# EAGLE design XMETER1 (EAGLE 4.16)
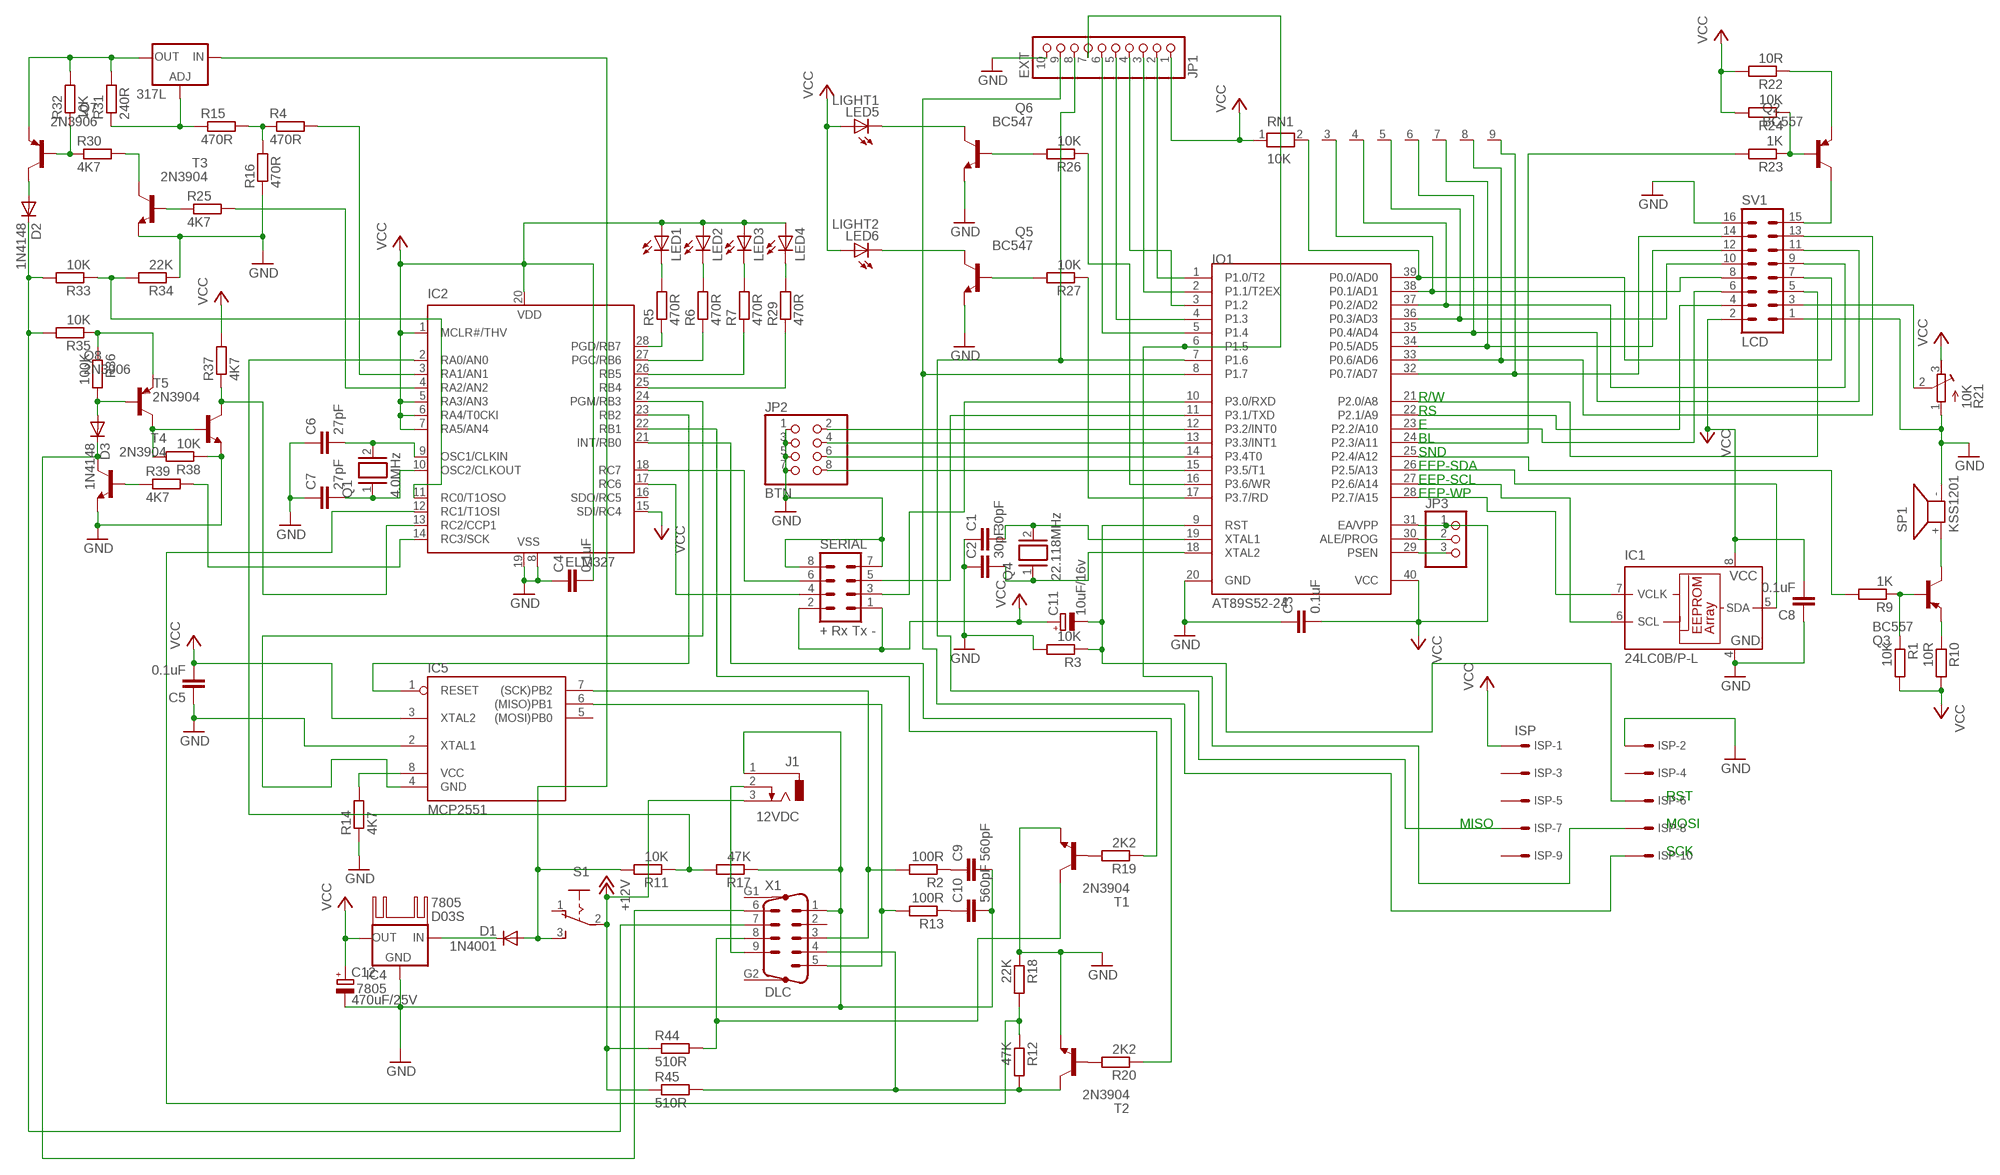
[diagram p0: schematic, sheet 1]

## Parts
317L  LM317L  [317L]
7805  D03S  [D03S]
C1  30pF  C-EU050-024X044  [C050-024X044]
C2  30pF  C-EU050-024X044  [C050-024X044]
C3  0.1uF  C-EU050-024X044  [C050-024X044]
C4  0.1uF  C-EU050-024X044  [C050-024X044]
C5  0.1uF  C-EU050-024X044  [C050-024X044]
C6  27pF  C-EU050-024X044  [C050-024X044]
C7  27pF  C-EU050-024X044  [C050-024X044]
C8  0.1uF  C-EU050-024X044  [C050-024X044]
C9  560pF  C-EU050-024X044  [C050-024X044]
C10  560pF  C-EU050-024X044  [C050-024X044]
C11  10uF/16v  CPOL-EUE5-5  [E5-5]
C12  470uF/25V  CPOL-EUE5-8.5  [E5-8,5]
D1  1N4001  1N4004  [DO41-10]
D2  1N4148  [DO35-10]
D3  1N4148  [DO35-10]
IC1  24LC0B/P-L  24LC21AP  [DIL8]
IC2  ELM327  PIC16LF872P  [DIL28-3]
IC4  7805  78XXS  [78XXS]
IC5  MCP2551  AT90LS2323P  [DIL08]
IO1  AT89S52-24  AT89C55  [PDIP40]
ISP  ISP  057-010-0  [057-010-0]
J1  12VDC  DCJ0202  [DCJ0202]
JP1  EXT  PINHD-1X10  [1X10]
JP2  BTN  PINHD-2X4  [2X04]
JP3  PINHD-1X3  [1X03]
LED1  LED3MM  [LED3MM]
LED2  LED3MM  [LED3MM]
LED3  LED3MM  [LED3MM]
LED4  LED3MM  [LED3MM]
LED5  LIGHT1  LED3MM  [LED3MM]
LED6  LIGHT2  LED3MM  [LED3MM]
Q1  4.0MHz  XTAL/S  [QS]
Q2  BC557  [TO92]
Q3  BC557  [TO92]
Q4  22.118MHz  XTAL/S  [QS]
Q5  BC547  [TO92]
Q6  BC547  [TO92]
Q7  2N3906  [TO92]
Q8  2N3906  [TO92]
R1  10K  R-EU_0207/10  [0207/10]
R2  100R  R-EU_0207/10  [0207/10]
R3  10K  R-EU_0207/10  [0207/10]
R4  470R  R-EU_0207/10  [0207/10]
R5  470R  R-EU_0207/10  [0207/10]
R6  470R  R-EU_0207/10  [0207/10]
R7  470R  R-EU_0207/10  [0207/10]
R9  1K  R-EU_0207/10  [0207/10]
R10  10R  R-EU_0207/10  [0207/10]
R11  10K  R-EU_0207/10  [0207/10]
R12  47K  R-EU_0207/10  [0207/10]
R13  100R  R-EU_0207/10  [0207/10]
R14  4K7  R-EU_0207/10  [0207/10]
R15  470R  R-EU_0207/10  [0207/10]
R16  470R  R-EU_0207/10  [0207/10]
R17  47K  R-EU_0207/10  [0207/10]
R18  22K  R-EU_0207/10  [0207/10]
R19  2K2  R-EU_0207/10  [0207/10]
R20  2K2  R-EU_0207/10  [0207/10]
R21  10K  R-TRIMM3339P  [RTRIM3339P]
R22  10R  R-EU_0207/10  [0207/10]
R23  1K  R-EU_0207/10  [0207/10]
R24  10K  R-EU_0207/10  [0207/10]
R25  4K7  R-EU_0207/10  [0207/10]
R26  10K  R-EU_0207/10  [0207/10]
R27  10K  R-EU_0207/10  [0207/10]
R29  470R  R-EU_0207/10  [0207/10]
R30  4K7  R-EU_0207/10  [0207/10]
R31  240R  R-EU_0207/10  [0207/10]
R32  10K  R-EU_0207/10  [0207/10]
R33  10K  R-EU_0207/10  [0207/10]
R34  22K  R-EU_0207/10  [0207/10]
R35  10K  R-EU_0207/10  [0207/10]
R36  100K  R-EU_0207/10  [0207/10]
R37  4K7  R-EU_0207/10  [0207/10]
R38  10K  R-EU_0207/10  [0207/10]
R39  4K7  R-EU_0207/10  [0207/10]
R44  510R  R-EU_0411/15  [0411/15]
R45  510R  R-EU_0411/15  [0411/15]
RN1  10K  RN08  [RN-9]
S1  M251  [M251]
SERIAL  + Rx Tx -  MA04-2  [MA04-2]
SP1  KSS1201  [KSS1201]
SV1  LCD  MA08-2  [MA08-2]
T1  2N3904  [TO92]
T2  2N3904  [TO92]
T3  2N3904  [TO92]
T4  2N3904  [TO92]
T5  2N3904  [TO92]
X1  DLC  M09HP  [M09HP]

## Nets
+12V [Power]: J1.3 R44.1 R45.1 S1.2(P)
GND: C1.1 C2.1 C3.1 C4.1 C5.1 C6.1 C7.1 C8.1 C9.2 C10.2 C12.- IC1.4(GND) IC2.8(VSS) IC2.19(VSS) IC4.GND IC5.2(XTAL1) IO1.20(GND) ISP.2 J1.1 JP1.10 JP2.1 JP2.3 JP2.5 JP2.7 Q5.1(E) Q6.1(E) R3.2 R14.1 R16.1 R17.1 R18.1 R21.1(E) R34.1 R38.1 SERIAL.7 SERIAL.8 SP1.- SV1.1 SV1.16 T1.3(E) T2.3(E) T3.3(E) T4.3(E) T5.3(E) X1.1
N$1: 317L.3(IN) D1.A R11.2 S1.3(S)
N$2: Q2.3(C) SV1.15
N$3 [Power]: D1.C IC4.IN
N$4: IO1.10(P3.0/RXD) SERIAL.3
N$5: IC2.18(RC7) SERIAL.6
N$6: IC1.5(SDA) IO1.26(P2.5/A13)
N$7: IO1.38(P0.1/AD1) RN1.3 SV1.8
N$8: C11.- IO1.9(RST) ISP.6 R3.1
N$9: IO1.37(P0.2/AD2) RN1.4 SV1.9
N$10: IO1.36(P0.3/AD3) RN1.5 SV1.10
N$11: IO1.35(P0.4/AD4) RN1.6 SV1.11
N$12: IO1.34(P0.5/AD5) RN1.7 SV1.12
N$13: IO1.33(P0.6/AD6) RN1.8 SV1.13
N$14: IO1.32(P0.7/AD7) RN1.9 SV1.14
N$15: Q2.1(E) R22.1
N$16: IO1.23(P2.2/A10) SV1.6
N$17: R21.2(S) SV1.3
N$19: IO1.14(P3.4T0) JP2.6
N$20: C1.2 IO1.19(XTAL1) Q4.2
N$21: IC2.23(RB2) IC5.1(RESET)
N$22: IO1.15(P3.5/T1) JP2.8
N$23: C6.2 IC2.9(OSC1/CLKIN) Q1.2
N$24: Q3.3(C) SP1.+
N$25: C7.2 IC2.10(OSC2/CLKOUT) Q1.1
N$26: IC2.24(PGM/RB3) IC5.4(GND)
N$27: IO1.6(P1.5) ISP.8 JP1.7
N$28: Q2.2(B) R23.1 R24.1
N$29: LED1.K(C) R5.2
N$30: LED2.K(C) R6.2
N$31: LED3.K(C) R7.2
N$32: LED4.K(C) R29.2
N$33: IC2.28(PGD/RB7) R5.1
N$34: IC2.27(PGC/RB6) R6.1
N$35: IC2.26(RB5) R7.1
N$36: IC2.25(RB4) R29.1
N$37: Q3.2(B) R1.1 R9.1
N$38: IO1.13(P3.3/INT1) JP2.4
N$39: IC5.6((MISO)PB1) R13.2 X1.5
N$40: Q3.1(E) R10.1
N$41: IC5.7((SCK)PB2) R2.2 X1.3
N$42: IC2.2(RA0/AN0) R11.1 R17.2
N$43: IC5.8(VCC) R14.2
N$44: C9.1 R2.1
N$45: C10.1 R13.1
N$46: R44.2 T1.1(C) X1.8
N$47: R12.2 R45.2 T2.1(C) X1.4
N$48: IC2.22(RB1) R19.1
N$49: IC2.12(RC1/T1OSI) R12.1 R18.2
N$50: R19.2 T1.2(B)
N$51: R20.2 T2.2(B)
N$52: LED6.K(C) Q5.3(C)
N$53: IO1.39(P0.0/AD0) RN1.2 SV1.7
N$54: IC2.21(INT/RB0) R20.1
N$55: 317L.1(ADJ) R15.1 R31.1
N$56: IO1.7(P1.6) ISP.7 JP1.8
N$57: IO1.8(P1.7) ISP.10 JP1.9
N$58: IO1.12(P3.2/INT0) JP2.2
N$59: IC1.6(SCL) IO1.27(P2.6/A14)
N$60: IO1.25(P2.4/A12) R9.2
N$61: IC1.7(VCLK) IO1.28(P2.7/A15)
N$62: IO1.22(P2.1/A9) SV1.4
N$63: IO1.21(P2.0/A8) SV1.5
N$64: IO1.24(P2.3/A11) R23.2
N$65: LED5.K(C) Q6.3(C)
N$66: C2.2 IO1.18(XTAL2) Q4.1
N$67: J1.2 X1.9
N$68: R4.1 R15.2 R16.2
N$69: IO1.11(P3.1/TXD) SERIAL.5
N$70: IC2.3(RA1/AN1) R4.2
N$71: Q6.2(B) R26.2
N$72: Q5.2(B) R27.2
N$73: IO1.16(P3.6/WR) R26.1
N$74: IO1.17(P3.7/RD) R27.1
N$75: 317L.2(OUT) Q7.3(E) R31.2 R32.2
N$76: Q7.2(B) R30.1 R32.1
N$77: R30.2 T3.1(C)
N$78: IO1.5(P1.4) JP1.6
N$79: IO1.3(P1.2) JP1.4
N$80: IO1.4(P1.3) JP1.5
N$81: IO1.2(P1.1/T2EX) JP1.3
N$82: IO1.1(P1.0/T2) JP1.2
N$83: R25.1 T3.2(B)
N$84: IC2.4(RA2/AN2) R25.2
N$85: D2.A Q7.1(C)
N$86: D2.C R33.2 R35.2 X1.7
N$87: IC2.11(RC0/T1OSO) R33.1 R34.2
N$88: Q8.1(C) R38.2 T5.2(B)
N$89: D3.A Q8.2(B) R36.2
N$90: Q8.3(E) R35.1 R36.1
N$91: IC2.14(RC3/SCK) R39.2
N$92: R39.1 T4.2(B)
N$93: D3.C T4.1(C) X1.6
N$95: IC2.13(RC2/CCP1) R37.1 T5.1(C)
N$99: IO1.30(ALE/PROG) JP3.2
N$100: IO1.29(PSEN) JP3.3
N$103: IC2.17(RC6) SERIAL.4
VCC: C3.2 C4.2 C5.2 C8.2 C11.+ C12.+ IC1.8(VCC) IC2.1(MCLR#/THV) IC2.5(RA3/AN3) IC2.6(RA4/T0CKI) IC2.7(RA5/AN4) IC2.15(SDI/RC4) IC2.20(VDD) IC4.OUT IC5.3(XTAL2) IO1.31(EA/VPP) IO1.40(VCC) ISP.1 JP1.1 JP3.1 LED1.A LED2.A LED3.A LED4.A LED5.A LED6.A R1.2 R10.2 R21.3(A) R22.2 R24.2 R37.2 RN1.1 SERIAL.1 SERIAL.2 SV1.2
Unconnected: IC2.16(SDO/RC5) IC5.5((MOSI)PB0) ISP.3 ISP.4 ISP.5 ISP.9 S1.1(O) X1.2 X1.G1 X1.G2

## Notes on the sheet
- R/W
- RS
- E
- BL
- SND
- EEP-SDA
- EEP-SCL
- EEP-WP
- RST
- MISO | MOSI
- SCK

## Library data of the parts
317L = v-reg:LM317L: VOLTAGE REGULATOR
7805 = heatsink:D03S: HEATSINK distributor Schukat
C1-C10 = rcl:C-EU: CAPACITOR, European symbol
C11 C12 = rcl:CPOL-EU: POLARIZED CAPACITOR, European symbol
D1 = diode:1N4004: DIODE general purpose rectifier, 1 A
D2 D3 = diode:1N4148: DIODE high speed (Philips)
IC1 = microchip:24L*: Serial EEPROM 128 byte/1 K
IC2 = microchip:PIC16*872: MICROCONTROLLER flash type
IC4 = v-reg:78XXS: VOLTAGE REGULATOR
IC5 = atmel:AT90*2323: MICROCONTROLLER 2 Kbytes FLASH 128 bytes SRAM 128 bytes EEPROM
IO1 = atmel89cxxxx:AT89C55
ISP = con-panduit:057-010-: CONNECTOR 10-pin series 057 contact pc board low profile headers
J1 = con-jack:DCJ0202: DC POWER JACK Source: DCJ0202.pdf
JP1 = pinhead:PINHD-1X10: PIN HEADER
JP2 = pinhead:PINHD-2X4: PIN HEADER
JP3 = pinhead:PINHD-1X3: PIN HEADER
LED1-LED6 = led:LED: LED OSRAM: - CHIPLED LG R971, LG N971, LY N971, LG Q971, LY Q971, LO R971, LY R971 LH N974, LH R974 LS Q976, LO Q976, LY Q976 LO Q996 - Hyper CHIPLED LW Q18S LB Q993, LB Q99A, LB R99A - SideLED LS A670, LO A670, LY A670, LG A670, LP A670 LB A673, LV A673, LT A673, LW A673 LH A674 LY A675 LS A676, LA A676, LO A676, LY A676, LW A676 LS A679, LY A679, LG A679 - Hyper Micro SIDELED® LS Y876, LA Y876, LO Y876, LY Y876 LT Y87S - SmartLED LW L88C, LW L88S LB L89C, LB L89S, LG L890 LS L89K, LO L89K, LY L89K LS L896, LA L896, LO L896, LY L896 - TOPLED LS T670, LO T670, LY T670, LG T670, LP T670 LSG T670, LSP T670, LSY T670, LOP T670, LYG T670 LG T671, LOG T671, LSG T671 LB T673, LV T673, LT T673, LW T673 LH T674 LS T676, LA T676, LO T676, LY T676, LB T676, LH T676, LSB T676, LW T676 LB T67C, LV T67C, LT T67C, LS T67K, LO T67K, LY T67K, LW E67C LS E67B, LA E67B, LO E67B, LY E67B, LB E67C, LV E67C, LT E67C LW T67C LS T679, LY T679, LG T679 LS T770, LO T770, LY T770, LG T770, LP T770 LB T773, LV T773, LT T773, LW T773 LH T774 LS E675, LA E675, LY E675, LS T675 LS T776, LA T776, LO T776, LY T776, LB T776 LHGB T686 LT T68C, LB T68C - Hyper Mini TOPLED® LB M676 - Mini TOPLED Santana® LG M470 LS M47K, LO M47K, LY M47K Source: http://www.osram.convergy.de - LUMILED® LXK2-PW12-R00, LXK2-PW12-S00, LXK2-PW14-U00, LXK2-PW14-V00 LXK2-PM12-R00, LXK2-PM12-S00, LXK2-PM14-U00 LXK2-PE12-Q00, LXK2-PE12-R00, LXK2-PE12-S00, LXK2-PE14-T00, LXK2-PE14-U00 LXK2-PB12-K00, LXK2-PB12-L00, LXK2-PB12-M00, LXK2-PB14-N00, LXK2-PB14-P00, LXK2-PB14-Q00 LXK2-PR12-L00, LXK2-PR12-M00, LXK2-PR14-Q00, LXK2-PR14-R00 LXK2-PD12-Q00, LXK2-PD12-R00, LXK2-PD12-S00 LXK2-PH12-R00, LXK2-PH12-S00 LXK2-PL12-P00, LXK2-PL12-Q00, LXK2-PL12-R00 Source: www.luxeon.com
Q1 Q4 = special:XTAL/S: CRYSTAL
Q2 Q3 = transistor-pnp:BC557: PNP Transistor
Q5 Q6 = transistor-npn:BC547*: NPN Transistor
Q7 Q8 = transistor-pnp:2N3906: PNP Transistor
R1-R7 R9-R20 R22-R27 R29-R39 R44 R45 = rcl:R-EU_: RESISTOR, European symbol
R21 = rcl:R-TRIMM: Trimm resistor
RN1 = resistor-net:RN08: RESISTOR NETWORK
S1 = switch:M251: SLIDING SWITCH Mors, distributor Buerklin, 11G702
SERIAL = con-lstb:MA04-2: PIN HEADER
SP1 = buzzer:KSS1201: SPEAKER Source: Schukat
SV1 = con-lstb:MA08-2: PIN HEADER
T1-T5 = transistor:2N3904: NPN TRANSISTOR
X1 = con-subd:M09HP: SUB-D

## Net classes
0 Signal: width 0.5 mm, drill 0.013 mm
1 Ground: width 1 mm, drill 0.2 mm
2 Power: width 1 mm, drill 0.2 mm

## Board
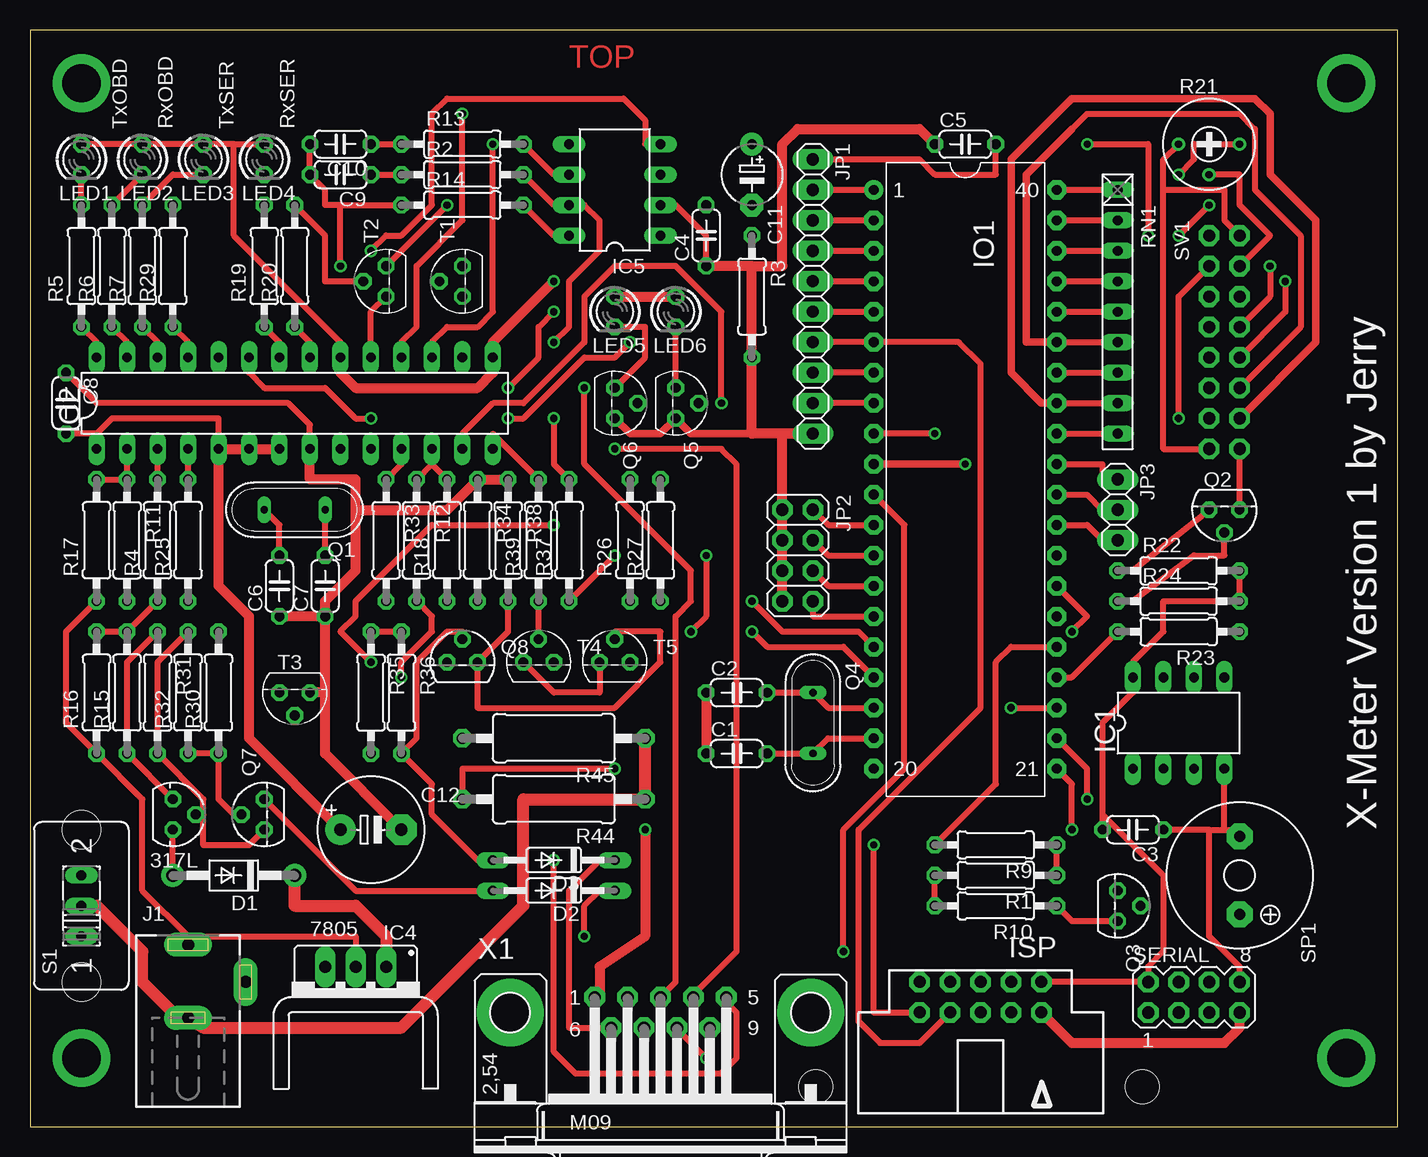
[diagram p1: board, top side]
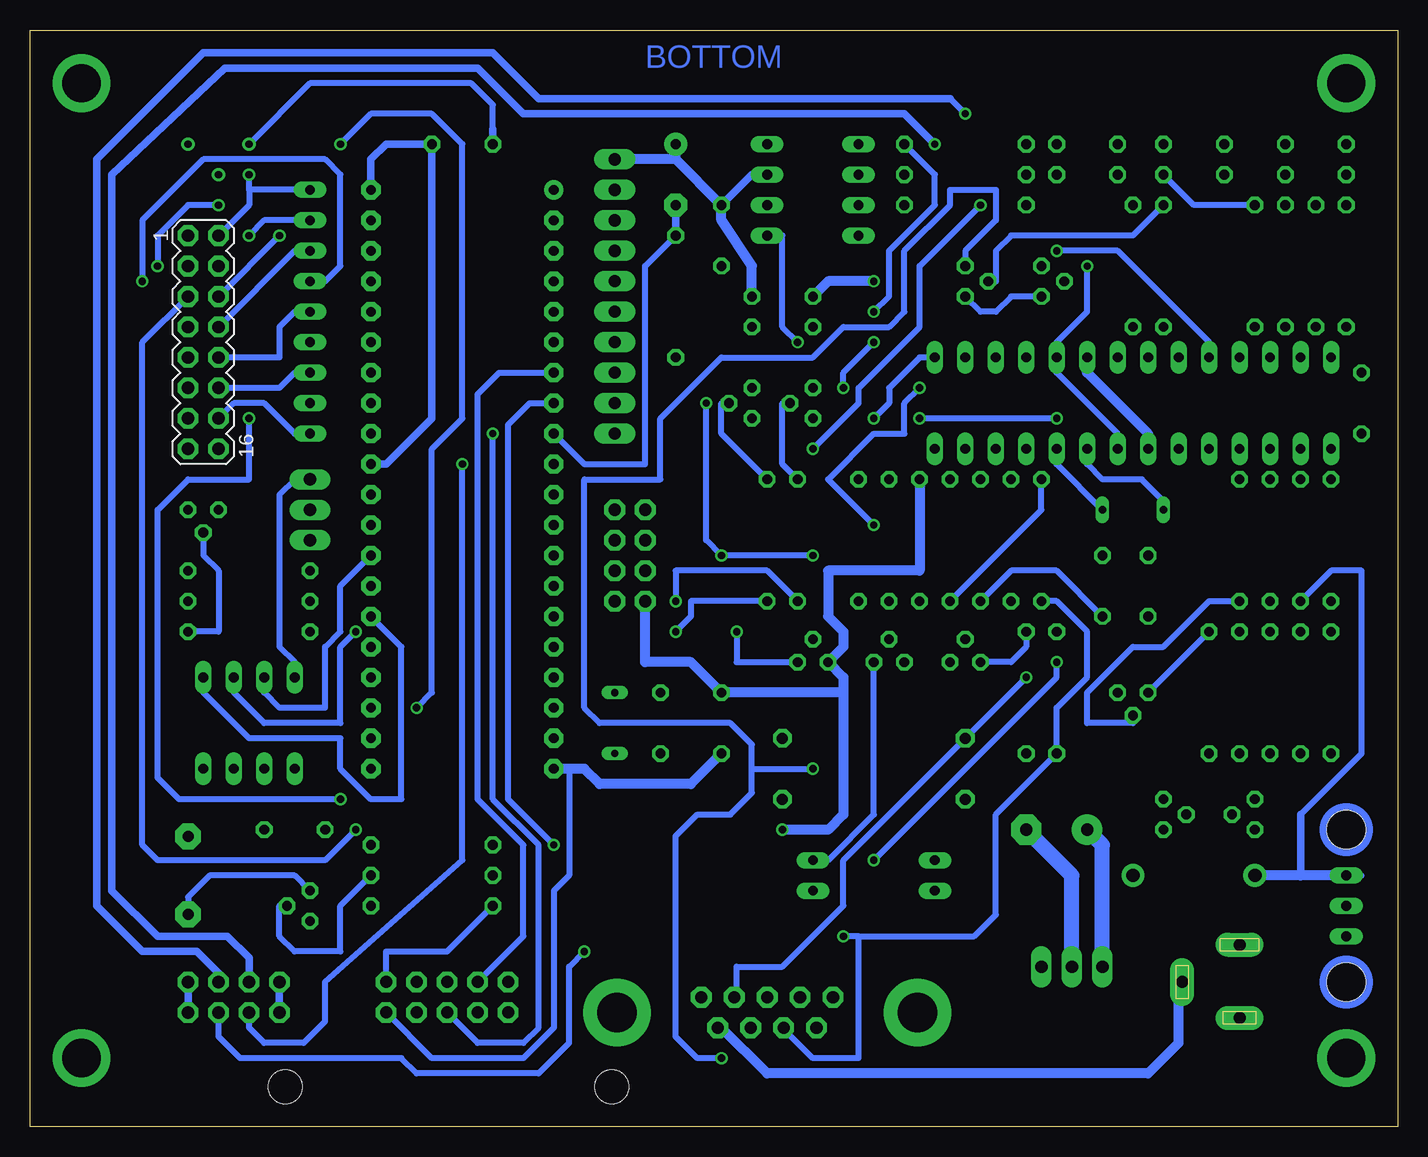
[diagram p2: board, bottom side, seen from below]

Size 113.97 x 91.43 mm. Coordinates in mm from the lower left corner, seen from the top.
Outline: 0,0 113.97,0 113.97,91.43 0,91.43 0,0
Copper layers (1*16): Top 0.035mm / dielectric 1.5mm / Bottom 0.035mm
Design rules "default": minimum track width 15mil, minimum drill 24mil, track to track 15mil, track to pad 15mil, pad to pad 15mil, via to via 15mil, smd to smd 8mil, copper to edge 40mil, drill to drill 8mil, minimum pad ring 10mil, minimum via ring 8mil, stop-mask expansion 4mil, vias tented up to drill 0mil, thermal gap 10mil
Holes 3.2 mm at 4.28,24.76 4.28,12.06

### Footprints (pad centres in the part's own frame; a part is rotated, then mirrored left to right if it is on the bottom)
317L = drill 0.813 octagon: 1 -1.27,0; 2 0,1.905; 3 1.27,0
C050-024X044 = drill 0.813 octagon: 1 -2.54,0; 2 2.54,0
E5-5 = drill 0.813 pad 1.905 round: + -2.54,0 | drill 0.813 pad 1.905 octagon: - 2.54,0
E5-8,5 = drill 1.016 pad 2.54 round: + -2.54,0 | drill 1.016 pad 2.54 octagon: - 2.54,0
DO41-10 = drill 1.118 round: A 5.08,0; C -5.08,0
DO35-10 = drill 0.813 long: A 5.08,0; C -5.08,0
DIL8 = drill 0.813 long: 1 -3.81,-3.81; 2 -1.27,-3.81; 3 1.27,-3.81; 4 3.81,-3.81; 5 3.81,3.81; 6 1.27,3.81; 7 -1.27,3.81; 8 -3.81,3.81
DIL28-3 = drill 0.813 long: 1 -16.51,-3.81; 2 -13.97,-3.81; 3 -11.43,-3.81; 4 -8.89,-3.81; 5 -6.35,-3.81; 6 -3.81,-3.81; 7 -1.27,-3.81; 8 1.27,-3.81; 9 3.81,-3.81; 10 6.35,-3.81; 11 8.89,-3.81; 12 11.43,-3.81; 13 13.97,-3.81; 14 16.51,-3.81; 15 16.51,3.81; 16 13.97,3.81; 17 11.43,3.81; 18 8.89,3.81; 19 6.35,3.81; 20 3.81,3.81; 21 1.27,3.81; 22 -1.27,3.81; 23 -3.81,3.81; 24 -6.35,3.81; 25 -8.89,3.81; 26 -11.43,3.81; 27 -13.97,3.81; 28 -16.51,3.81
78XXS = drill 1.016 long: GND 0,-2.54; IN -2.54,-2.54; OUT 2.54,-2.54
DIL08 = drill 0.813 long: 1 -3.81,-3.81; 2 -1.27,-3.81; 3 1.27,-3.81; 4 3.81,-3.81; 5 3.81,3.81; 6 1.27,3.81; 7 -1.27,3.81; 8 -3.81,3.81
PDIP40 = drill 0.813 pad 1.6 round: 1 -19.05,-7.62 | drill 0.813 pad 1.6 octagon: 2 -16.51,-7.62; 3 -13.97,-7.62; 4 -11.43,-7.62; 5 -8.89,-7.62; 6 -6.35,-7.62; 7 -3.81,-7.62; 8 -1.27,-7.62; 9 1.27,-7.62; 10 3.81,-7.62; 11 6.35,-7.62; 12 8.89,-7.62; 13 11.43,-7.62; 14 13.97,-7.62; 15 16.51,-7.62; 16 19.05,-7.62; 17 21.59,-7.62; 18 24.13,-7.62; 19 26.67,-7.62; 20 29.21,-7.62; 21 29.21,7.62; 22 26.67,7.62; 23 24.13,7.62; 24 21.59,7.62; 25 19.05,7.62; 26 16.51,7.62; 27 13.97,7.62; 28 11.43,7.62; 29 8.89,7.62; 30 6.35,7.62; 31 3.81,7.62; 32 1.27,7.62; 33 -1.27,7.62; 34 -3.81,7.62; 35 -6.35,7.62; 36 -8.89,7.62; 37 -11.43,7.62; 38 -13.97,7.62; 39 -16.51,7.62; 40 -19.05,7.62
057-010-0 = drill 1 octagon: 1 -5.08,-5.08; 2 -5.08,-2.54; 3 -2.54,-5.08; 4 -2.54,-2.54; 5 0,-5.08; 6 0,-2.54; 7 2.54,-5.08; 8 2.54,-2.54; 9 5.08,-5.08; 10 5.08,-2.54 | hole 2.8: -13.48,3.66; 13.73,3.66
DCJ0202 = drill 1 pad 2 long: 1 0,3.1; 2 4.8,0; 3 0,-3
1X10 = drill 1.016 long: 1 -11.43,0; 2 -8.89,0; 3 -6.35,0; 4 -3.81,0; 5 -1.27,0; 6 1.27,0; 7 3.81,0; 8 6.35,0; 9 8.89,0; 10 11.43,0
2X04 = drill 1.016 octagon: 1 -3.81,-1.27; 2 -3.81,1.27; 3 -1.27,-1.27; 4 -1.27,1.27; 5 1.27,-1.27; 6 1.27,1.27; 7 3.81,-1.27; 8 3.81,1.27
1X03 = drill 1.016 long: 1 -2.54,0; 2 0,0; 3 2.54,0
LED3MM = drill 0.813 octagon: A -1.27,0; K 1.27,0
QS = drill 0.61 long: 1 -2.54,0; 2 2.54,0
TO92 = drill 0.813 octagon: 1 1.27,0; 2 0,1.905; 3 -1.27,0
0207/10 = drill 0.813 octagon: 1 -5.08,0; 2 5.08,0
RTRIM3339P = drill 0.61 round: 1 -2.54,0; 2 0,-2.54; 3 2.54,0
0411/15 = drill 0.914 octagon: 1 -7.62,0; 2 7.62,0
RN-9 = drill 0.813 long: 1 -10.16,0; 2 -7.62,0; 3 -5.08,0; 4 -2.54,0; 5 0,0; 6 2.54,0; 7 5.08,0; 8 7.62,0; 9 10.16,0
M251 = drill 0.813 long: 1 -2.54,0; 2 0,0; 3 2.54,0
MA04-2 = drill 1.016 octagon: 1 -3.81,-1.27; 2 -3.81,1.27; 3 -1.27,-1.27; 4 -1.27,1.27; 5 1.27,-1.27; 6 1.27,1.27; 7 3.81,-1.27; 8 3.81,1.27
KSS1201 = drill 0.914 pad 2.159 octagon: + 3.251,0; - -3.251,0
MA08-2 = drill 1.016 octagon: 1 -8.89,-1.27; 2 -8.89,1.27; 3 -6.35,-1.27; 4 -6.35,1.27; 5 -3.81,-1.27; 6 -3.81,1.27; 7 -1.27,-1.27; 8 -1.27,1.27; 9 1.27,-1.27; 10 1.27,1.27; 11 3.81,-1.27; 12 3.81,1.27; 13 6.35,-1.27; 14 6.35,1.27; 15 8.89,-1.27; 16 8.89,1.27
M09HP = drill 1.016 octagon: 1 -5.486,1.27; 2 -2.743,1.27; 3 0,1.27; 4 2.743,1.27; 5 5.486,1.27; 6 -4.115,-1.27; 7 -1.372,-1.27; 8 1.372,-1.27; 9 4.115,-1.27 | drill 3.302 pad 5.08 round: G1 -12.522,0; G2 12.522,0

### Placement (x,y rotation side)
317L  11.9,26.03 270 top
7805  27.14,9.52 180 top
C1  58.89,31.11 0 top
C2  58.89,36.19 0 top
C3  91.91,24.76 180 top
C4  56.35,74.29 90 top
C5  77.94,81.91 0 top
C6  20.79,45.08 90 top
C7  24.6,45.08 90 top
C8  3.01,60.32 270 top
C9  25.87,79.37 180 top
C10  25.87,81.91 180 top
C11  60.16,79.37 270 top
C12  28.41,24.76 0 top
D1  16.98,20.95 180 top
D2  43.65,19.68 180 top
D3  43.65,22.22 180 top
IC1  95.72,33.65 0 top
IC2  22.06,60.32 0 top
IC4  27.14,10.79 180 top
IC5  48.73,78.1 90 top
IO1  77.94,59.05 270 top
ISP  79.21,6.98 180 top
J1  13.17,12.06 0 top
JP1  65.24,69.21 270 top
JP2  63.97,47.62 270 top
JP3  90.64,51.43 270 top
LED1  4.28,80.64 270 top
LED2  9.36,80.64 270 top
LED3  14.44,80.64 270 top
LED4  19.52,80.64 270 top
LED5  48.73,67.94 270 top
LED6  53.81,67.94 270 top
Q1  22.06,51.43 180 top
Q2  99.53,51.43 180 top
Q3  90.64,18.41 270 top
Q4  65.24,33.65 270 top
Q5  53.81,60.32 270 top
Q6  48.73,60.32 270 top
Q7  19.52,26.03 90 top
Q8  36.03,38.73 0 top
R1  80.48,20.95 180 top
R2  36.03,79.37 0 top
R3  60.16,69.21 270 top
R4  10.63,48.89 90 top
R5  4.28,71.75 90 top
R6  6.82,71.75 90 top
R7  9.36,71.75 90 top
R9  80.48,23.49 180 top
R10  80.48,18.41 180 top
R11  8.09,48.89 270 top
R12  32.22,48.89 270 top
R13  36.03,81.91 0 top
R14  36.03,76.83 0 top
R15  8.09,36.19 90 top
R16  5.55,36.19 90 top
R17  5.55,48.89 90 top
R18  34.76,48.89 90 top
R19  19.52,71.75 90 top
R20  22.06,71.75 90 top
R21  98.26,81.91 0 top
R22  95.72,46.35 0 top
R23  95.72,41.27 180 top
R24  95.72,43.81 0 top
R25  13.17,48.89 90 top
R26  50,48.89 90 top
R27  52.54,48.89 90 top
R29  11.9,71.75 90 top
R30  15.71,36.19 90 top
R31  10.63,36.19 270 top
R32  13.17,36.19 90 top
R33  29.68,48.89 270 top
R34  37.3,48.89 270 top
R35  28.41,36.19 270 top
R36  30.95,36.19 270 top
R37  44.92,48.89 90 top
R38  39.84,48.89 270 top
R39  42.38,48.89 90 top
R44  43.65,27.3 180 top
R45  43.65,32.38 180 top
RN1  90.64,67.94 270 top
S1  4.28,18.41 90 top
SERIAL  96.99,10.79 0 top
SP1  100.8,20.95 270 top
SV1  99.53,65.4 270 bottom
T1  36.03,70.48 90 top
T2  29.68,70.48 90 top
T3  22.06,36.19 180 top
T4  42.38,38.73 0 top
T5  48.73,38.73 0 top
X1  52.54,9.52 0 top

### Tracks (layer width: path | path; a pad name or v marks a point on that pad's centre or on a via)
+12V
  Top 1: R45.1 R44.1 41.11,27.3 41.11,18.41 30.95,8.25 14.44,8.25 J1.3 11.9,9.52 9.36,12.06 9.36,14.6 5.55,18.41 S1.2
GND  (via drill 0.61)
  Top 0.5: SV1.16 94.45,56.51 94.45,78.1 | 94.45,78.1 94.45,80.64 R21.1 | C4.1 56.35,74.29 53.81,76.83 IC5.2 | T4.3 43.65,36.19 47.46,36.19 T5.3 | 47.46,10.79 X1.1 | C10.2 C9.2 24.6,78.1 24.6,76.83 25.87,76.83 | 25.87,76.83 R14.1 | C8.1 5.55,60.32 21.53,60.32 23.33,58.52 IC2.8 | T2.3 28.41,67.94 IC2.19 | v25.87,71.75 25.87,76.83 | R17.1 3.01,41.27 3.01,33.65 R16.1 9.36,27.3 9.36,19.68 13.17,15.87 | 13.17,15.87 27.14,15.87 IC4.GND | J1.1 13.17,15.87 | 99.53,24.76 100.8,24.76 SP1.- | 98.26,24.76 99.53,24.76 | 98.26,24.76 C3.1 | 99.53,24.76 IC1.4 | SERIAL.8 100.8,13.33 98.26,15.87 98.26,24.76 | SV1.1 99.53,75.56 99.53,78.1 94.45,78.1
  Top 0.61: 60.16,57.78 55.08,57.78 Q5.1 52.54,57.78 50,57.78 Q6.1
  Top 0.813: C2.1 C1.1 | 47.46,10.79 47.46,13.33 51.27,15.87 v51.27,24.76 | R38.1 R34.1 34.76,51.43 27.14,51.43 | IC2.8 23.33,53.97 27.14,53.97 27.14,51.43 | 27.14,51.43 27.14,46.35 24.6,43.81 C7.1 | C7.1 C6.1 | 24.6,36.19 C7.1 | 24.6,36.19 T3.3 | 24.6,36.19 24.6,31.11 C12.- | JP2.7 JP2.5 JP2.3 JP2.1 62.7,57.78 JP1.10 60.16,57.78 R3.2 60.16,71.75 | 60.16,71.75 C4.1 | 60.16,71.75 62.7,71.75 62.7,81.91 63.97,83.18 74.13,83.18 C5.1 | ISP.2 86.83,6.98 99.53,6.98 100.8,8.25 SERIAL.7
  Bottom 0.5: R21.1 90.64,86.99 77.2,86.99 75.4,85.19 75.4,83.18 | IC2.8 23.33,57.78 28.41,62.86 IC2.19 28.41,65.4 25.87,67.94 v25.87,71.75 | T2.3 32.22,69.21 33.49,67.94 34.76,67.94 T1.3 | R18.1 32.22,46.35 28.41,46.35 C7.1 | IC4.GND 27.14,14.6 | ISP.2 80.48,5.71 72.86,5.71 70.32,8.25 70.32,19.68 69.05,20.95 69.05,29.84 IO1.20
  Bottom 0.61: SERIAL.7 SERIAL.8 | C5.1 75.4,83.18
  Bottom 0.813: 46.19,36.19 C2.1 58.89,38.73 62.7,38.73 JP2.7 | 46.19,36.19 46.19,26.03 47.46,24.76 v51.27,24.76 | 46.19,36.19 46.19,37.46 T5.3 46.19,40 46.19,41.27 47.46,42.54 47.46,46.35 39.84,46.35 R38.1 | C1.1 58.89,28.57 66.51,28.57 67.78,29.84 IO1.20
  Bottom 1.27: C12.- 27.14,20.95 IC4.GND
N$1
  Top 0.5: D1.A 317L.3
  Bottom 0.5: S1.3 3.01,20.95 | R11.2 5.55,46.35 3.01,46.35 3.01,31.11 8.09,26.03
  Bottom 0.61: 8.09,20.95 8.09,26.03
  Bottom 0.813: S1.3 8.09,20.95 D1.A
N$2
  Top 0.5: Q2.3 SV1.15
N$3
  Top 1: D1.C 22.06,18.41 27.14,18.41 29.68,15.87 IC4.IN
N$4  (via drill 0.61)
  Top 0.61: v77.94,55.24 IO1.10
  Bottom 0.5: v77.94,55.24 77.94,22.22 89.37,12.06 89.37,8.78 91.17,6.98 94.45,6.98 95.72,8.25 SERIAL.3
N$5  (via drill 0.61)
  Top 0.5: v36.03,84.45 36.03,75.56 32.22,71.75 32.22,66.67 30.95,65.4 IC2.18
  Bottom 0.5: v36.03,84.45 37.3,85.72
  Bottom 0.61: SERIAL.6 98.26,12.8 100.06,14.6 104.61,14.6 108.42,18.41 108.42,80.64 99.53,89.53 75.4,89.53 71.59,85.72 37.3,85.72
N$6
  Bottom 0.5: IO1.26 83.02,40 83.02,27.3 85.56,27.3 88.1,29.84 88.1,32.38 95.72,32.38 99.53,36.19 IC1.5
N$7
  Top 0.5: IO1.38 RN1.3
  Bottom 0.5: SV1.8 91.91,73.02 RN1.3
N$8  (via drill 0.61)
  Top 0.5: v75.4,57.78 IO1.9
  Bottom 0.5: IO1.9 67.78,55.24 62.7,55.24 62.7,71.75 R3.1 | ISP.6 76.67,6.98 72.86,6.98 71.59,8.25 71.59,23.49 75.4,27.3 v75.4,57.78
  Bottom 0.61: R3.1 C11.-
N$9  (via drill 0.61)
  Top 0.5: IO1.37 RN1.4 | SV1.9 104.61,67.94 v104.61,70.48
  Bottom 0.5: v104.61,70.48 104.61,75.56 99.53,80.64 89.37,80.64 88.1,79.37 88.1,71.75 89.37,70.48 RN1.4
N$10
  Top 0.5: IO1.36 RN1.5
  Bottom 0.5: SV1.10 93.18,64.13 93.18,66.67 91.91,67.94 RN1.5
N$11
  Top 0.5: IO1.35 RN1.6 | SV1.11 105.88,66.67 105.88,74.29 102.07,78.1 102.07,83.18 100.8,84.45 88.1,84.45 86.83,83.18
  Top 0.61: 86.83,83.18 83.02,79.37 83.02,65.4 IO1.35
N$12
  Top 0.5: IO1.34 RN1.7
  Bottom 0.5: SV1.12 93.18,61.59 91.91,62.86 RN1.7
N$13
  Top 0.5: IO1.33 RN1.8
  Top 0.61: IO1.33 84.29,60.32 81.75,62.86 81.75,80.64 86.83,85.72 102.07,85.72 103.34,84.45 103.34,79.37 107.15,75.56 107.15,65.4 SV1.13
N$14
  Top 0.5: IO1.32 RN1.9
  Bottom 0.5: SV1.14 96.99,60.32 94.45,60.32 91.91,57.78 RN1.9
N$15
  Top 0.5: R22.1 91.91,46.35 Q2.1
N$16  (via drill 0.61)
  Top 0.5: v81.75,34.92 IO1.23 | v88.1,81.91 93.18,81.91 v93.18,74.29
  Bottom 0.5: v81.75,34.92 80.48,36.19 80.48,56.51 77.94,59.05 77.94,81.91 80.48,84.45 85.56,84.45 v88.1,81.91 | v93.18,74.29 SV1.6
N$17
  Top 0.5: R21.2 100.8,79.37 100.8,76.83 103.34,74.29 SV1.3
N$19
  Top 0.5: IO1.14 66.51,45.08 JP2.6
N$20
  Top 0.5: C1.2 Q4.2 66.51,32.38 IO1.19
N$21  (via drill 0.61)
  Top 0.5: v28.41,59.05 27.14,59.05 24.6,61.59 19.52,61.59 18.25,62.86 IC2.23 | v39.84,59.05 41.11,59.05 46.19,64.13 48.73,64.13 v50,65.4
  Bottom 0.5: v28.41,59.05 v39.84,59.05 | v50,65.4 51.27,66.67 51.27,74.29 IC5.1
N$22
  Top 0.5: IO1.15 65.24,42.54 JP2.8
N$23
  Top 0.5: Q1.2 20.79,50.16 C6.2
  Bottom 0.5: Q1.2 19.52,52.17 21.32,53.97 24.6,53.97 25.87,55.24 IC2.9
N$24
  Bottom 0.5: Q3.3 91.91,20.95 99,20.95 100.8,19.15 SP1.+
N$25
  Top 0.5: C7.2 Q1.1
  Bottom 0.5: Q1.1 28.41,55.24 IC2.10
N$26  (via drill 0.61)
  Top 0.5: v28.41,73.02 29.68,74.29 30.95,74.29 33.49,76.83 33.49,84.45 34.76,85.72 49.47,85.72 51.27,83.92 51.27,81.91 IC5.4
  Bottom 0.5: v28.41,73.02 23.33,73.02 15.71,65.4 IC2.24
N$27
  Top 0.5: JP1.7 IO1.6 77.41,65.4 79.21,63.6 79.21,34.92 69.05,24.76 69.05,8.78 70.85,6.98 74.13,6.98 ISP.8
N$28
  Top 0.5: R24.1 91.91,43.81 96.99,47.62 99.53,47.62 Q2.2
  Bottom 0.5: R23.1 98.26,41.27 98.26,46.35 99.53,47.62 Q2.2
N$29
  Top 0.5: R5.2 LED1.K
N$30
  Top 0.5: R6.2 LED2.K
N$31
  Top 0.5: R7.2 11.9,79.37 LED3.K
N$32
  Bottom 0.5: R29.2 16.98,76.83 LED4.K
N$33
  Top 0.5: R5.1 5.55,65.4 IC2.28
N$34
  Top 0.5: R6.1 8.09,65.4 IC2.27
N$35
  Top 0.5: R7.1 10.63,65.4 IC2.26
N$36
  Top 0.5: R29.1 13.17,65.4 IC2.25
N$37
  Top 0.5: R1.1 R9.1
  Bottom 0.5: R1.1 88.1,18.41 88.1,14.6 91.91,14.6 93.18,15.87 93.18,18.41 Q3.2
N$38
  Top 0.5: IO1.13 66.51,47.62 JP2.4
N$39  (via drill 0.61)
  Top 0.5: R13.2 43.65,79.37 IC5.6 | v43.65,22.22 43.65,6.24 45.45,4.44 57.62,4.44 58.89,5.71 58.89,9.52 57.62,10.79 X1.5 | v28.41,38.73 25.87,41.27 27.14,42.54 27.14,43.81 33.49,50.16 v43.65,50.16 | v39.84,61.59 42.38,64.13 42.38,66.67 v43.65,67.94
  Bottom 0.5: v43.65,22.22 28.41,37.46 v28.41,38.73 | v43.65,50.16 47.46,53.97 43.65,57.78 41.11,57.78 41.11,60.32 v39.84,61.59 | v43.65,67.94 42.38,69.21 42.38,73.02 38.57,76.83 38.57,79.37 R13.2
N$40
  Top 0.5: R10.1 86.83,17.14 Q3.1
N$41  (via drill 0.61)
  Top 0.5: R2.2 43.65,76.83 IC5.7 46.19,76.83 47.46,75.56 47.46,73.02 44.92,70.48 44.92,66.67 v43.65,65.4 | X1.3 53.81,12.06 53.81,42.54 55.08,43.81 55.08,46.35 46.19,55.24 v46.19,61.59
  Bottom 0.5: v46.19,61.59 46.19,62.86 v43.65,65.4
N$42
  Top 0.5: R17.2 R11.1 IC2.2
N$43
  Top 0.5: R14.2 43.65,74.29 IC5.8
N$44
  Top 0.5: C9.1 R2.1
N$45
  Top 0.5: C10.1 R13.1
N$46  (via drill 0.61)
  Top 0.5: v48.73,29.84 36.03,29.84 R44.2 | v56.35,5.71 53.81,8.25 X1.8
  Bottom 0.5: T1.1 36.03,73.02 33.49,75.56 33.49,78.1 37.3,78.1 37.3,76.83 41.11,73.02 41.11,67.94 42.38,66.67 46.19,66.67 48.73,64.13 56.35,64.13 61.43,59.05 61.43,53.97 67.78,53.97 67.78,34.92 66.51,33.65 55.61,33.65 53.81,31.85 53.81,29.84 | 53.81,29.84 v48.73,29.84 | v56.35,5.71 58.36,5.71 60.16,7.51 60.16,24.23 58.36,26.03 55.61,26.03 53.81,27.83 53.81,29.84
N$47  (via drill 0.61)
  Top 0.5: R12.2 33.49,42.54 33.49,41.27 30.95,38.73 v30.95,37.46 | v34.76,76.83 T2.1 | v48.73,56.51 57.62,56.51 58.89,55.24 58.89,14.6 55.08,10.79 X1.4
  Bottom 0.5: v30.95,37.46 R45.2 46.19,22.22 46.19,18.41 51.27,13.33 55.08,13.33 55.08,10.79 X1.4 | v34.76,76.83 39.84,71.75 39.84,66.67 44.92,61.59 44.92,60.32 v48.73,56.51
N$48
  Top 0.5: R19.1 20.79,65.4 IC2.22
N$49
  Top 0.5: R12.1 33.49,55.24 | 33.49,55.24 R18.2 | 33.49,55.24 IC2.12
N$50
  Bottom 0.5: R19.2 22.06,74.29 32.22,74.29 33.49,73.02 33.49,70.48 T1.2
N$51
  Top 0.5: R20.2 24.6,74.29 24.6,70.48 T2.2
N$52
  Top 0.5: Q5.3 LED6.K
N$53  (via drill 0.61)
  Top 0.5: IO1.39 RN1.2 | SV1.7 103.34,69.21 v103.34,71.75 | v95.72,74.29 v98.26,76.83
  Bottom 0.5: v103.34,71.75 103.34,74.29 100.8,76.83 v98.26,76.83 | v95.72,74.29 94.45,75.56 RN1.2
N$54
  Top 0.5: R20.1 23.33,65.4 IC2.21
N$55
  Top 0.5: 317L.1 R15.1 8.09,38.73 R31.1
N$56
  Top 0.5: IO1.7 JP1.8
  Bottom 0.5: ISP.7 72.86,15.87 72.86,23.49 76.67,27.3 76.67,61.06 74.87,62.86 IO1.7
N$57  (via drill 0.61)
  Top 0.5: IO1.8 JP1.9 | ISP.10 70.32,9.52 v70.32,23.49
  Bottom 0.5: v70.32,23.49 74.13,27.3 74.13,58.52 72.33,60.32 IO1.8
N$58
  Top 0.5: IO1.12 66.51,50.16 JP2.2
N$59  (via drill 0.61)
  Top 0.5: v86.83,41.27 88.1,42.54 IO1.27
  Bottom 0.5: v86.83,41.27 88.1,40 88.1,33.65 94.45,33.65 96.99,36.19 IC1.6
N$60
  Top 0.5: R9.2 80.48,28.57 80.48,38.73 81.75,40 IO1.25
N$61
  Bottom 0.5: IO1.28 88.1,45.08 88.1,41.27 89.37,40 89.37,34.92 93.18,34.92 94.45,36.19 IC1.7
N$62  (via drill 0.61)
  Top 0.5: IO1.22 88.1,29.84 v88.1,27.3 | v95.72,59.05 95.72,69.21 SV1.4
  Bottom 0.5: v88.1,27.3 101.54,27.3 103.34,29.1 103.34,51.43 100.8,53.97 95.72,53.97 v95.72,59.05
N$63  (via drill 0.61)
  Top 0.5: IO1.21 86.83,28.57 v86.83,24.76
  Bottom 0.5: v86.83,24.76 89.37,22.22 103.34,22.22 104.61,23.49 104.61,65.4 SV1.5
N$64
  Top 0.5: R23.2 86.83,37.46 IO1.24
N$65
  Top 0.5: Q6.3 51.27,64.13 51.27,66.67 LED5.K
N$66
  Top 0.5: C2.2 Q4.1 66.51,34.92 IO1.18
N$67
  Bottom 0.5: 56.35,8.25 X1.9
  Bottom 0.813: 56.35,8.25 52.54,4.44 20.79,4.44 18.25,6.98 18.25,12.06 J1.2
N$68
  Top 0.5: R16.2 R15.2 R4.1
N$69  (via drill 0.61)
  Top 0.5: IO1.11 72.86,50.16 72.86,29.84 67.78,24.76 v67.78,14.6
  Bottom 0.5: v67.78,14.6 69.05,13.33 69.05,6.98 71.59,4.44 81.75,4.44 83.02,5.71 96.46,5.71 98.26,7.51 SERIAL.5
N$70
  Top 0.5: R4.2 IC2.3
N$71
  Bottom 0.5: R26.2 51.27,55.24 51.27,60.32 Q6.2
N$72
  Bottom 0.5: R27.2 56.35,57.78 56.35,60.32 Q5.2
N$73  (via drill 0.61)
  Top 0.5: v60.16,43.81 62.7,41.27 69.05,41.27 IO1.16
  Bottom 0.5: R26.1 52.54,46.35 60.16,46.35 v60.16,43.81
N$74  (via drill 0.61)
  Top 0.5: v60.16,41.27 61.43,40 67.78,40 IO1.17
  Bottom 0.5: R27.1 58.89,43.81 58.89,42.54 v60.16,41.27
N$75
  Top 0.5: 14.44,26.03 14.44,27.3 R31.2 10.63,38.73 R32.2 | Q7.3 18.25,23.49 14.44,23.49 14.44,26.03 | 14.44,26.03 317L.2
N$76
  Top 0.5: Q7.2 16.98,26.03 15.71,27.3 R30.1 R32.1
N$77
  Bottom 0.5: R30.2 T3.1
N$78
  Top 0.5: JP1.6 IO1.5
N$79
  Top 0.5: JP1.4 IO1.3
N$80
  Top 0.5: JP1.5 IO1.4
N$81
  Top 0.5: JP1.3 IO1.2
N$82
  Top 0.5: JP1.2 IO1.1
N$83
  Bottom 0.5: R25.1 15.71,43.81 19.52,40 22.06,40 25.87,36.19 25.87,33.65 22.06,33.65 T3.2
N$84
  Top 0.5: R25.2 IC2.4
N$85
  Top 0.5: Q7.1 27.14,19.68 D2.A
N$86  (via drill 0.61)
  Top 0.5: v46.19,15.87 46.19,18.41 47.46,19.68 D2.C
  Bottom 0.5: 44.92,15.87 v46.19,15.87 | 44.92,15.87 35.29,15.87 33.49,17.67 33.49,26.03 R35.2 28.41,34.92 25.87,37.46 25.87,41.27 28.41,43.81 R33.2 | 44.92,15.87 44.92,5.71 48.73,5.71 51.27,8.25 X1.7
N$87
  Top 0.5: R33.1 30.95,55.24 IC2.11
  Bottom 0.5: R34.2 29.68,51.43 R33.1
N$88
  Top 0.5: R38.2 39.84,41.27 Q8.1 37.3,34.92 48.73,34.92 52.54,38.73 52.54,41.27 48.73,41.27 T5.2
N$89
  Top 0.5: D3.A 37.3,22.22 33.49,26.03 33.49,28.57 R36.2 32.22,32.38 32.22,38.73 34.76,41.27 36.03,41.27 Q8.2
N$90
  Top 0.5: R35.1 R36.1
  Bottom 0.5: R36.1 30.95,40 32.22,38.73 Q8.3
N$91
  Top 0.5: R39.2 38.57,57.78 IC2.14
N$92
  Top 0.5: T4.2 R39.1
N$93
  Top 0.5: 48.73,8.25 X1.6 44.92,8.25 44.92,19.68 47.46,22.22 D3.C
  Bottom 0.5: T4.1 43.65,26.03 47.46,22.22 D3.C
N$94  (via drill 3.2)
  other vias: 4.28,5.71
N$95  (via drill 0.61)
  Top 0.5: v55.08,41.27 56.35,42.54 v56.35,47.62 | R37.1 v48.73,47.62 | v57.62,60.32 57.62,67.94 53.81,71.75 48.73,71.75 46.19,69.21 46.19,65.4 41.11,60.32 38.57,60.32 36.03,57.78 IC2.13
  Bottom 0.5: T5.1 55.08,38.73 v55.08,41.27 | v48.73,47.62 v56.35,47.62 57.62,48.89 v57.62,60.32
N$96  (via drill 3.2)
  other vias: 4.28,86.99
N$97  (via drill 3.2)
  other vias: 109.69,86.99
N$98  (via drill 3.2)
  other vias: 109.69,5.71
N$99
  Top 0.5: IO1.30 88.1,52.7 89.37,51.43 JP3.2
N$100
  Top 0.5: IO1.29 88.1,50.16 89.37,48.89 JP3.3
N$103  (via drill 0.61)
  Top 0.5: v38.57,81.91 38.57,67.94 37.3,66.67 34.76,66.67 33.49,65.4 IC2.17
  Bottom 0.61: v38.57,81.91 41.11,84.45 72.86,84.45 76.67,88.26 97.73,88.26 107.15,79.37 107.15,19.68 103.34,15.87 97.52,15.87 95.72,14.07 SERIAL.4
VCC  (via drill 0.61)
  Top 0.5: LED1.A LED2.A LED3.A 16.98,81.91 | 16.98,81.91 LED4.A | 5.55,57.78 C8.2 | R37.2 43.65,55.24 v43.65,59.05 | 5.55,57.78 6.82,59.05 15.71,59.05 IC2.5 | 5.55,57.78 IC2.1 | 16.98,81.91 16.98,74.29 25.87,65.4 IC2.20 | R10.2 R1.2 | R22.2 R24.2 94.45,43.81 94.45,41.27 91.91,38.73 IC1.8 91.91,36.19 89.37,33.65 89.37,26.03 | IO1.31 89.37,55.24 89.37,53.97 JP3.1 | IO1.40 RN1.1 | C5.2 80.48,79.37 75.4,79.37 74.13,80.64 JP1.1 | ISP.1 SERIAL.2 93.18,13.33 94.45,14.6 94.45,20.95 89.37,26.03 | 89.37,26.03 C3.2 | R21.3 96.99,81.91 96.99,80.64 v95.72,79.37
  Top 0.813: C12.+ 18.25,32.38 18.25,42.54 15.71,45.08 IC2.5 IC2.6 IC2.7 | IC2.20 25.87,62.86 27.14,61.59 37.3,61.59 38.57,62.86 IC2.15 38.57,65.4 v43.65,70.48 | LED5.A LED6.A
  Bottom 0.5: IC4.OUT 24.6,14.6 | v43.65,59.05 42.38,60.32 42.38,61.59 39.84,64.13 IC2.15 | 95.72,78.1 95.72,76.83 SV1.2 | RN1.1 95.72,78.1 | IC1.8 91.91,38.73 93.18,40 93.18,52.7 91.91,53.97 JP3.1 | R10.2 79.21,14.6 84.29,14.6 ISP.1 | 95.72,78.1 v95.72,79.37
  Bottom 0.61: SERIAL.2 SERIAL.1 | IC5.3 53.81,79.37 C4.2 | IO1.40 85.56,80.64 84.29,81.91 C5.2 80.48,59.05 84.29,55.24 IO1.31
  Bottom 0.813: IC2.7 20.79,57.78 25.87,62.86 IC2.20 | v43.65,70.48 47.46,70.48 LED5.A | LED6.A 53.81,71.75 56.35,75.56 C4.2 60.16,80.64 | 60.16,80.64 C11.+ | 60.16,80.64 JP1.1
  Bottom 1.27: C12.+ 24.6,23.49 IC4.OUT
(copper drawn outside any net)
  shapes: Bottom circle x2

### Text on the board
Top: TOP
Bottom: BOTTOM
tPlace: TxOBD | RxOBD | TxSER | RxSER | X-Meter Version 1 by Jerry